# EAGLE schematic controller (EAGLE 7.1.2)
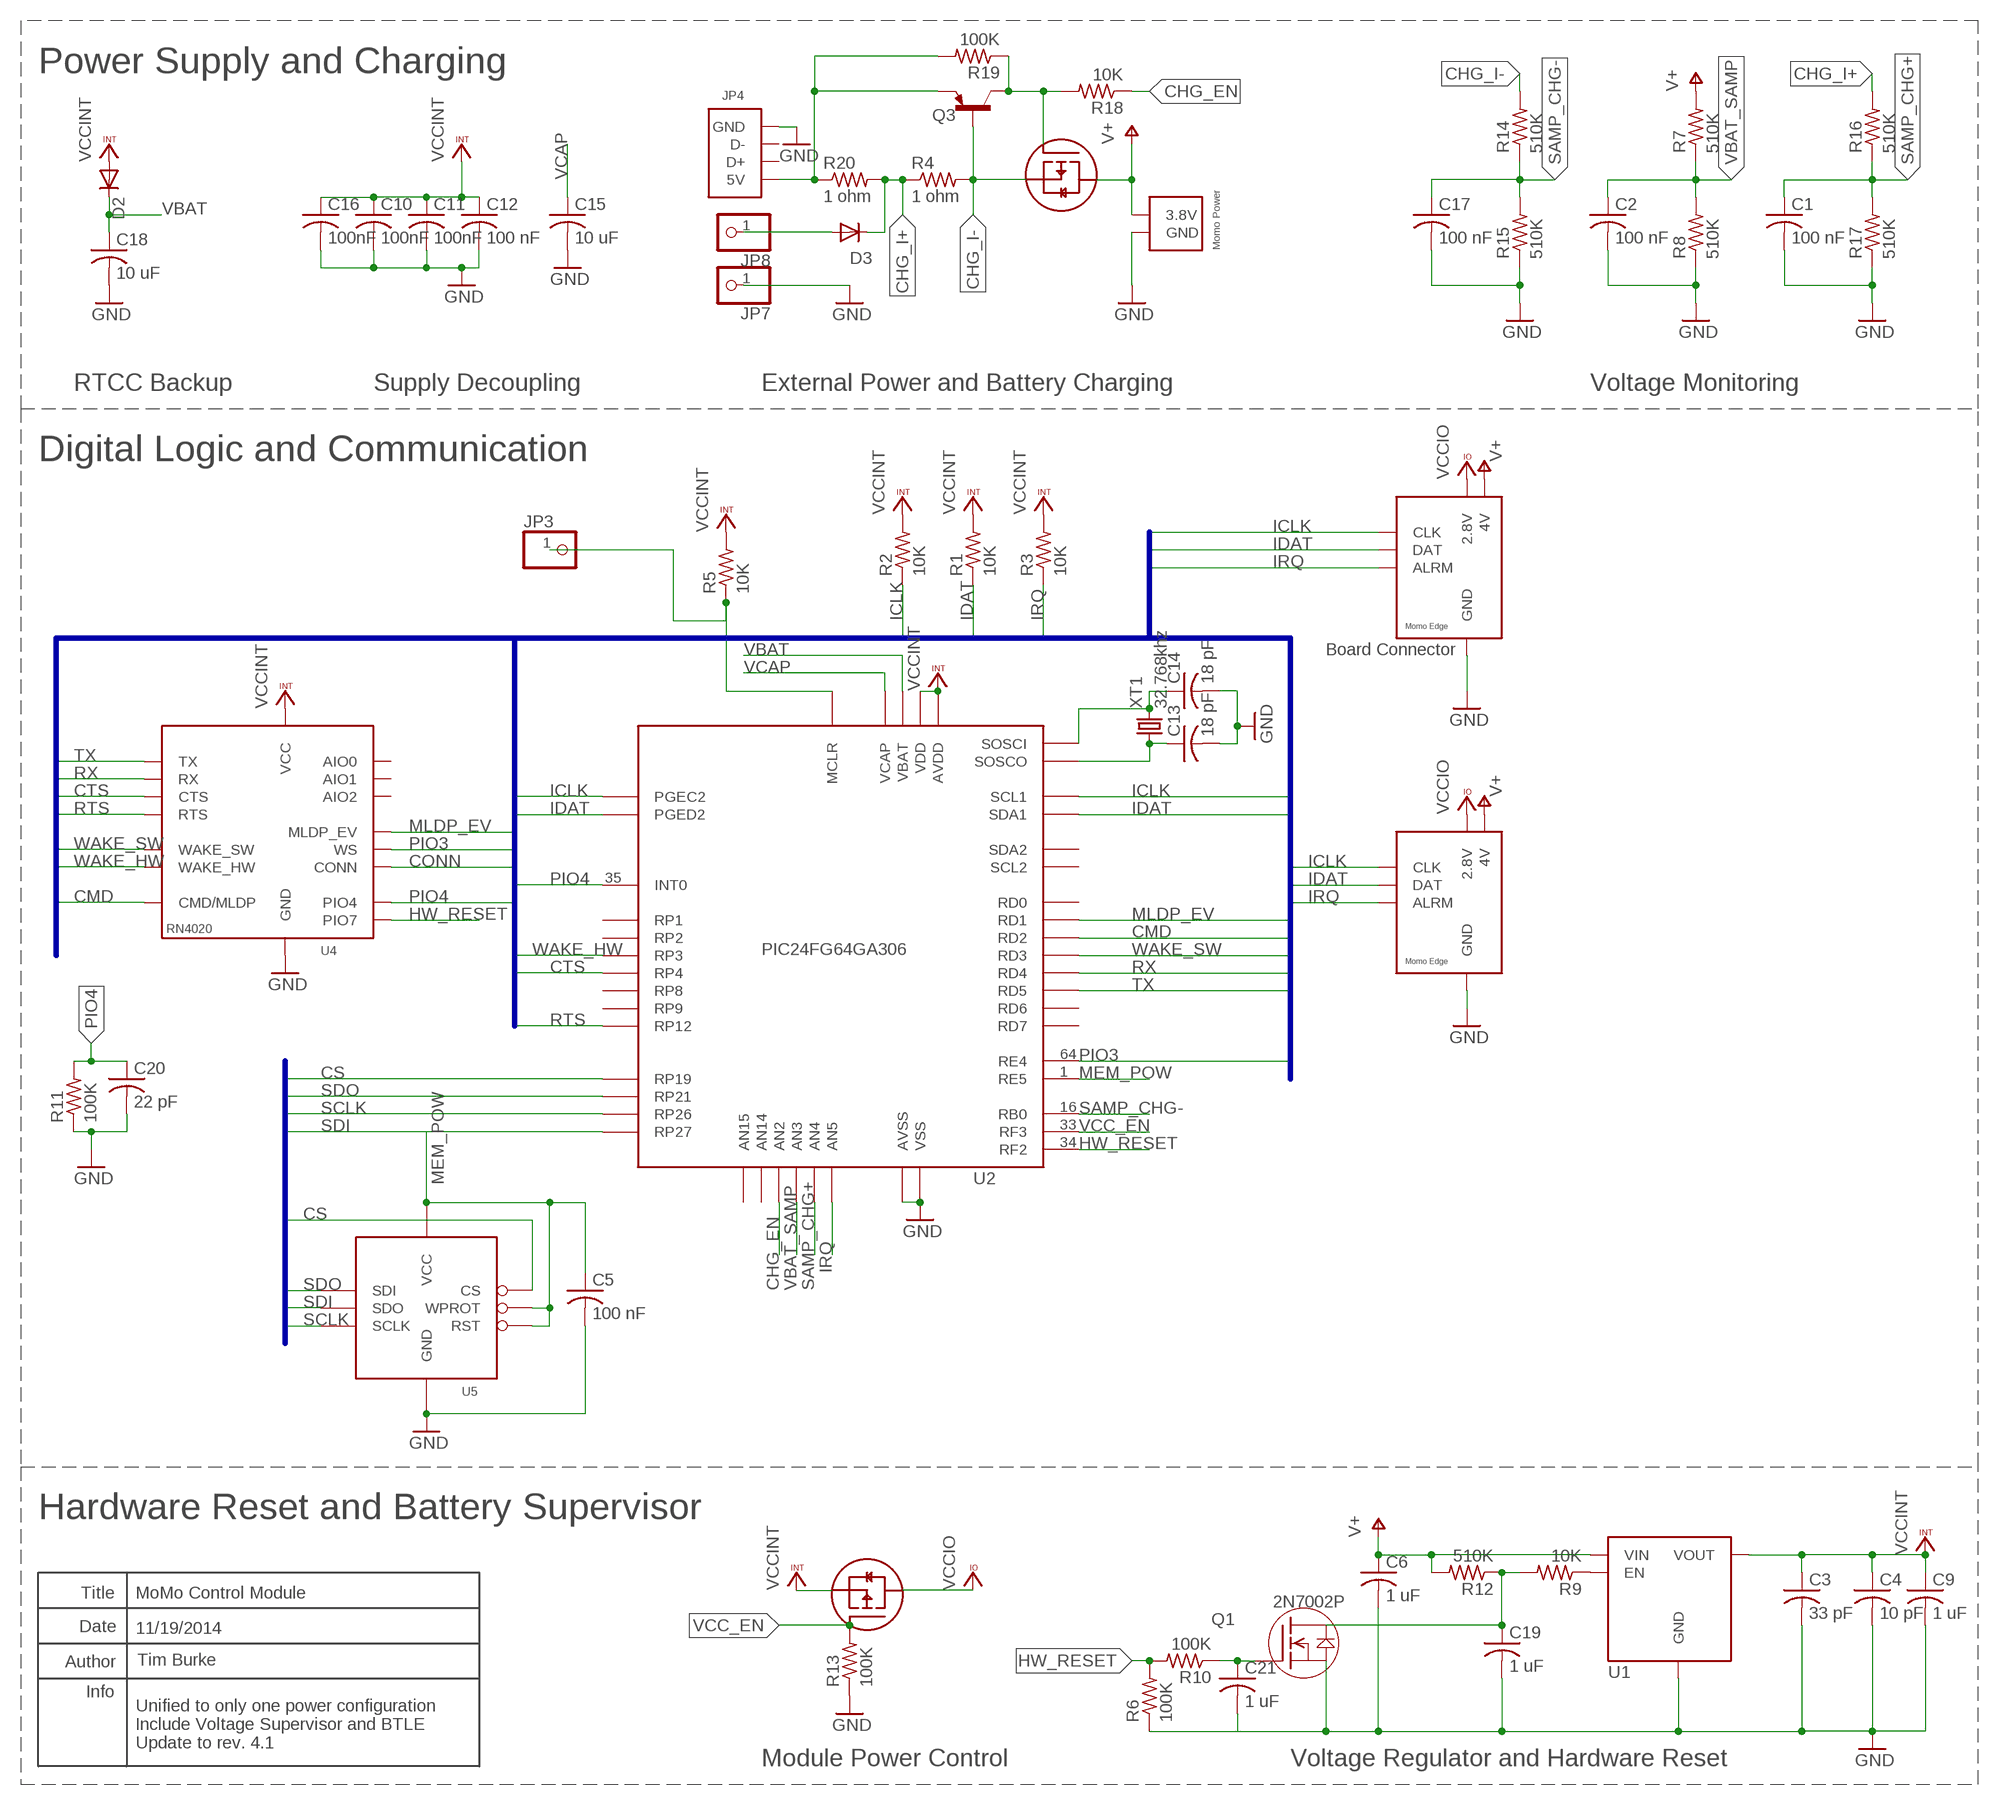
[diagram p0: schematic, sheet 1]

## Parts
C1  100 nF  C-USC0402K  [C0402K]
C2  100 nF  C-USC0402K  [C0402K]
C3  33 pF  C-USC0402K  [C0402K]
C4  10 pF  C-USC0402K  [C0402K]
C5  100 nF  C-USC0402K  [C0402K]
C6  1 uF  C-USC0402K  [C0402K]
C9  1 uF  C-USC0402K  [C0402K]
C10  100nF  C-USC0402K  [C0402K]
C11  100nF  C-USC0402K  [C0402K]
C12  100 nF  C-USC0402K  [C0402K]
C13  18 pF  C-USC0402K  [C0402K]
C14  18 pF  C-USC0402K  [C0402K]
C15  10 uF  C-USC0805K  [C0805K]
C16  100nF  C-USC0402K  [C0402K]
C17  100 nF  C-USC0402K  [C0402K]
C18  10 uF  C-USC0805K  [C0805K]
C19  1 uF  C-USC0402K  [C0402K]
C20  22 pF  C-USC0402K  [C0402K]
C21  1 uF  C-USC0402K  [C0402K]
D2  DIODE-SC79_INFINEON  [SC79_INFINEON]
D3  DIODE-SC79_INFINEON  [SC79_INFINEON]
JP1  MOMO-VERT-6M  [1X06]
JP2  MOMO-EDGE-6F  [MOMO-EDGE-8F]
JP3  PINHD-1X1  [1X01]
JP4  CONN-MICROUSB-B-RCPT  [MICROUSB-B-FCI]
JP5  MOMO-PWR-HOUSED  [MOMO-PWR-HOUSED]
JP7  PINHD-1X1  [1X01]
JP8  PINHD-1X1  [1X01]
Q1  MOSFET-N  [SOT-23]
Q2  P-MOSFET  [SOT23]
Q3  MMBTA56-SOT23  [SOT23]
Q4  P-MOSFET  [SOT23]
R1  10K  R-US_R0603  [R0603]
R2  10K  R-US_R0603  [R0603]
R3  10K  R-US_R0603  [R0603]
R4  1 ohm  R-US_R1206  [R1206]
R5  10K  R-US_R0603  [R0603]
R6  100K  R-US_R0603  [R0603]
R7  510K  R-US_R0603  [R0603]
R8  510K  R-US_R0603  [R0603]
R9  10K  R-US_R0603  [R0603]
R10  100K  R-US_R0603  [R0603]
R11  100K  R-US_R0603  [R0603]
R12  510K  R-US_R0603  [R0603]
R13  100K  R-US_R0603  [R0603]
R14  510K  R-US_R0603  [R0603]
R15  510K  R-US_R0603  [R0603]
R16  510K  R-US_R0603  [R0603]
R17  510K  R-US_R0603  [R0603]
R18  10K  R-US_R0603  [R0603]
R19  100K  R-US_R0603  [R0603]
R20  1 ohm  R-US_R1206  [R1206]
U1  XC6504-LINEAR-REGULATOR  [SOT23-5L]
U2  PIC24FJ64GA306  [TQFP64-10X10]
U4  RN4020_BT_4.0_MODULE  [RN20-BTLE-MODULE]
U5  FLASH8MSOP8  [SOP08]
XT1  32.768khz  XTAL-W-CAN-PAD  [TC26H]

## Nets
CHG_EN: R18.1 U2.14(AN2)
CHG_I+: D3.C R4.1 R16.2 R20.2
CHG_I-: Q3.1(B) Q4.2(SOURCE) R4.2 R14.2
CMD: U2.50(RD2) U4.CMD/MLDP
CONN: U4.PIO1(CONN)
CS: U2.6(RP19) U5.1(CS)
CTS: U2.43(RP4) U4.PIO5(CTS)
GND: C1.2 C2.2 C3.2 C4.2 C5.2 C6.2 C9.2 C10.2 C11.2 C12.2 C13.2 C14.2 C15.2 C16.2 C17.2 C18.2 C19.2 C20.2 C21.2 JP1.7(GND) JP2.GND JP4.5(GND) JP4.GND2(GND) JP4.GND3(GND) JP4.GND4(GND) JP4.GND5(GND) JP4.GND6(GND) JP5.2(GND) JP7.1 Q1.2(S) R6.1 R8.1 R11.1 R13.1 R15.1 R17.1 U1.2(GND) U2.9(VSS) U2.20(AVSS) U2.25(VSS) U2.41(VSS) U4.GND U4.GND1(GND) U4.SHIELD1(GND) U4.SHIELD2(GND) U4.SHIELD3(GND) U4.SHIELD4(GND) U5.4(GND)
HW_RESET: R6.2 R10.2 U2.34(RF2) U4.PIO7
ICLK: JP1.3(CLK) JP2.CLK R2.1 U2.17(PGEC2) U2.37(SCL1)
IDAT: JP1.4(DAT) JP2.DAT R1.1 U2.18(PGED2) U2.36(SDA1)
IRQ: JP1.5(ALRM) JP2.ARLM(ALRM) R3.1 U2.11(AN5)
MEM_POW: C5.1 U2.1(RE5) U5.3(WPROT) U5.7(RST) U5.8(VCC)
MLDP_EV: U2.49(RD1) U4.PIO2(MLDP_EV)
N$1: R9.1 U1.3(EN)
N$2: C21.1 Q1.1(G) R10.1
N$3: D3.A JP8.1
N$4: JP3.1 R5.1 U2.7(MCLR)
N$5: JP4.1(5V) Q3.2(E) R19.2 R20.1
N$6: C14.1 U2.47(SOSCI) XT1.2
N$7: C13.1 U2.48(SOSCO) XT1.1
N$10: Q3.3(C) Q4.1(GATE) R18.2 R19.1
N$11: C19.1 Q1.3(D) R9.2 R12.1
PIO3: U2.64(RE4) U4.PIO3(WS)
PIO4: C20.1 R11.2 U2.35(INT0) U4.PIO4
RTS: U2.45(RP12) U4.RTS/PIO6(RTS)
RX: U2.52(RD4) U4.UART_RX(RX)
SAMP_CHG+: C1.1 R16.1 R17.2 U2.12(AN4)
SAMP_CHG-: C17.1 R14.1 R15.2 U2.16(RB0)
SCLK: U2.5(RP26) U5.6(SCLK)
SDI: U2.8(RP27) U5.2(SDO)
SDO: U2.4(RP21) U5.5(SDI)
TX: U2.53(RD5) U4.UART_TX(TX)
V+: C6.1 JP1.6(4V) JP2.V4(4V) JP5.1(3.8V) Q4.3(DRAIN) R7.2 R12.2 U1.1(VIN)
VBAT: C18.1 D2.C U2.57(VBAT)
VBAT_SAMP: C2.1 R7.1 R8.2 U2.13(AN3)
VCAP: C15.1 U2.56(VCAP)
VCC_EN: Q2.1(GATE) R13.2 U2.33(RF3)
VCCINT: C3.1 C4.1 C9.1 C10.1 C11.1 C12.1 C16.1 D2.A Q2.2(SOURCE) R1.2 R2.2 R3.2 R5.2 U1.5(VOUT) U2.10(VDD) U2.19(AVDD) U2.26(VDD) U2.38(VDD) U4.VDD(VCC)
VCCIO: JP1.1(2.8V) JP2.V28(2.8V) Q2.3(DRAIN)
WAKE_HW: U2.44(RP3) U4.WAKE_HW
WAKE_SW: U2.51(RD3) U4.WAKE_SW
Unconnected: JP4.2(D-) JP4.3(D+) U2.15(RP1) U2.21(RP8) U2.22(RP9) U2.29(AN14) U2.30(AN15) U2.31(SDA2) U2.32(SCL2) U2.42(RP2) U2.46(RD0) U2.54(RD6) U2.55(RD7) U4.AIO0 U4.AIO1 U4.AIO2

## Buses
SPI:CS,SDI,SDO,SCLK
SENSOR:ICLK,IDAT,IRQ,RTS,CTS,RX,TX,WAKE_SW,WAKE_HW,CMD,MLDP_EV,CONN,PIO4,PIO7,PIO3

## Notes on the sheet
- Power Supply and Charging
- RTCC Backup | Supply Decoupling | External Power and Battery Charging | Voltage Monitoring
- Digital Logic and Communication
- Board Connector
- Hardware Reset and Battery Supervisor
- Title | MoMo Control Module
- 2N7002P
- Date | 11/19/2014
- Author | Tim Burke
- Info
- Unified to only one power configuration
  Include Voltage Supervisor and BTLE
  Update to rev. 4.1
- Module Power Control | Voltage Regulator and Hardware Reset

## Library data of the parts
C1 C2 C5 C10-C12 C16 C17 = rcl:C-US: CAPACITOR, American symbol; DIGIKEY-PN: 445-1265-1-ND
C3 = rcl:C-US: CAPACITOR, American symbol; DIGIKEY-PN: 1276-1272-1-ND
C4 = rcl:C-US: CAPACITOR, American symbol; DIGIKEY-PN: 1276-1139-1-ND
C6 C9 C19 C21 = rcl:C-US: CAPACITOR, American symbol; DIGIKEY-PN: 445-4114-1-ND
C13 C14 = rcl:C-US: CAPACITOR, American symbol; DIGIKEY-PN: 445-1238-1-ND
C15 C18 = rcl:C-US: CAPACITOR, American symbol; DIGIKEY-PN: 1276-2893-1-ND
C20 = rcl:C-US: CAPACITOR, American symbol; DIGIKEY-PN: 1276-1116-1-ND
D2 D3 = diode:DIODE-: DIODE
JP1 = components:MOMO-VERT-6M; DIGIKEY-PN: S1011EC-06-ND
JP2 = components:MOMO-EDGE-6F; DESCRIPTION: 6-pin female R/A header; DIGIKEY-PN: S5442-ND; FOOTPRINT: Through Hole
JP3 = pinhead:PINHD-1X1: PIN HEADER; POPULATE: no
JP4 = custom_ics:CONN-MICROUSB-B-RCPT; DESCRIPTION: MicroUSB-B Receptacle; DIGIKEY-PN: 609-4613-1-ND; FOOTPRINT: Custom SMD
JP5 = components:MOMO-PWR-HOUSED; DESCRIPTION: R/A Shrouded 2 pin connector; DIGIKEY-PN: 455-1719-ND; FOOTPRINT: Through HOle
JP7 JP8 = pinhead:PINHD-1X1: PIN HEADER
Q1 = custom_ics:MOSFET-N; DESCRIPTION: N-Channel MOSFET 2N7002P; DIGIKEY-PN: 568-5818-1-ND; FOOTPRINT: SOT-23
Q2 = components:P-MOSFET; DESCRIPTION: P Channel MOSFET; DIGIKEY-PN: IRLML6402PBFCT-ND
Q3 = transistor-pnp:*-?: PNP Transistor; DESCRIPTION: PNP Transistor; DIGIKEY-PN: 568-1742-1-ND; FOOTPRINT: SOT23
Q4 = components:P-MOSFET; DIGIKEY-PN: IRLML6402PBFCT-ND
R1-R3 R5 R9 R18 = rcl:R-US_: RESISTOR, American symbol; DIGIKEY-PN: P10.0KHCT-ND
R4 R20 = rcl:R-US_: RESISTOR, American symbol; DIGIKEY-PN: 311-1.00FRCT-ND
R6 R10 R11 R13 R19 = rcl:R-US_: RESISTOR, American symbol; DIGIKEY-PN: P100KHCT-ND
R7 R8 R12 R14-R17 = rcl:R-US_: RESISTOR, American symbol; DIGIKEY-PN: P510KHCT-ND
U1 = custom_ics:XC6504-LINEAR-REGULATOR; DESCRIPTION: XC6504 Linear Regulator 2.8V; DIGIKEY-PN: 893-1200-1-ND; FOOTPRINT: SOT23-5
U2 = components:PIC24FJ64GA306; DESCRIPTION: PIC24FJ64GA306 Microcontroller; DIGIKEY-PN: PIC24FJ64GA306-I/PT-ND; FOOTPRINT: TQFN64-10mm
U4 = custom_ics:RN4020_BT_4.0_MODULE; DESCRIPTION: RN4020 Bluetooth 4.0 Module; DIGIKEY-PN: RN4020-V/RM-ND; FOOTPRINT: Custom SMD
U5 = components:FLASH8M; DESCRIPTION: M25PX80 1MB Serial Flash; DIGIKEY-PN: M25PX80-VMN6TPCT-ND
XT1 = components:XTAL-W-CAN-PAD; DESCRIPTION: Quartz Crystal (Radial Can); DIGIKEY-PN: 535-9034-ND; FOOTPRINT: Through Hole

## Net classes
0 default: width 0.152 mm, drill 0.305 mm, clearance 0.152 mm